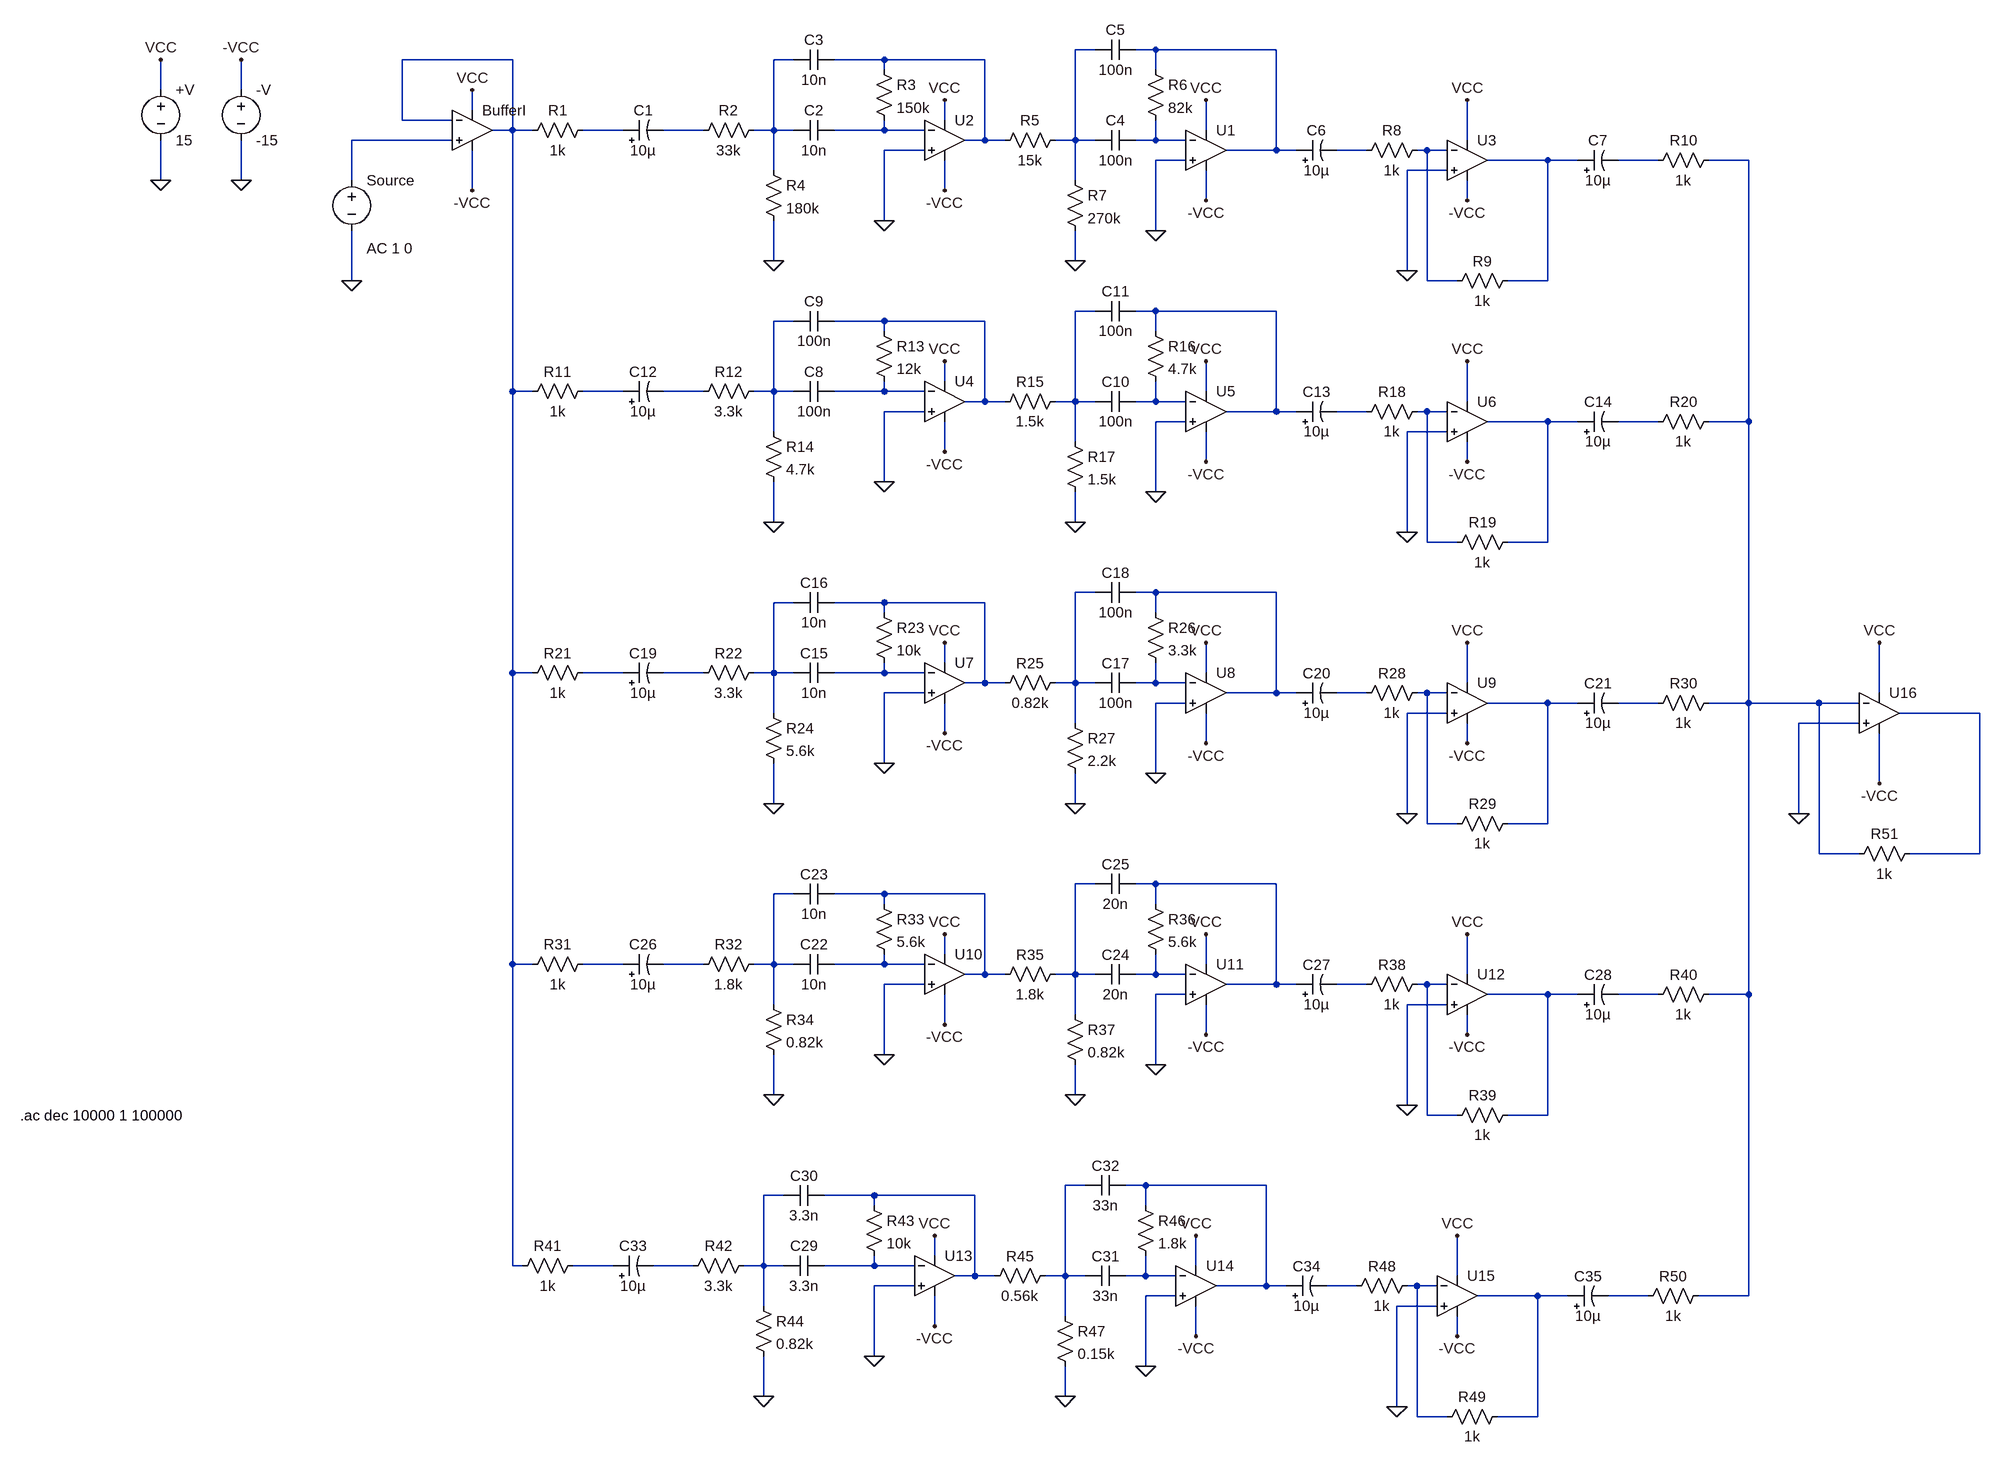
[diagram p0: schematic Five band equilizer final.asc]
Five band equilizer final.asc, the LTspice schematic file:
Version 4
SHEET 1 5876 2256
WIRE 976 32 944 32
WIRE 1072 32 1040 32
WIRE 1264 32 1072 32
WIRE 48 48 -128 48
WIRE 496 48 464 48
WIRE 640 48 560 48
WIRE 800 48 640 48
WIRE 640 64 640 48
WIRE 1072 64 1072 32
WIRE -512 96 -512 48
WIRE -384 96 -384 48
WIRE -16 128 -16 96
WIRE -128 144 -128 48
WIRE -48 144 -128 144
WIRE 736 144 736 112
WIRE 48 160 48 48
WIRE 48 160 16 160
WIRE 80 160 48 160
WIRE 224 160 160 160
WIRE 352 160 288 160
WIRE 464 160 464 48
WIRE 464 160 432 160
WIRE 496 160 464 160
WIRE 640 160 640 144
WIRE 640 160 560 160
WIRE 704 160 640 160
WIRE 1152 160 1152 112
WIRE -48 176 -208 176
WIRE 800 176 800 48
WIRE 800 176 768 176
WIRE 832 176 800 176
WIRE 944 176 944 32
WIRE 944 176 912 176
WIRE 976 176 944 176
WIRE 1072 176 1072 144
WIRE 1072 176 1040 176
WIRE 1120 176 1072 176
WIRE 1568 176 1568 112
WIRE 704 192 640 192
WIRE 1264 192 1264 32
WIRE 1264 192 1184 192
WIRE 1296 192 1264 192
WIRE 1408 192 1360 192
WIRE 1504 192 1488 192
WIRE 1536 192 1504 192
WIRE 1120 208 1072 208
WIRE 1696 208 1600 208
WIRE 1744 208 1696 208
WIRE 1872 208 1808 208
WIRE 2016 208 1952 208
WIRE 464 224 464 160
WIRE 1536 224 1472 224
WIRE -512 240 -512 176
WIRE -384 240 -384 176
WIRE -208 240 -208 176
WIRE 944 240 944 176
WIRE -16 256 -16 192
WIRE 736 256 736 208
WIRE 1152 272 1152 224
WIRE 1568 272 1568 240
WIRE 640 304 640 192
WIRE 1072 320 1072 208
WIRE 464 368 464 304
WIRE 944 368 944 320
WIRE 1472 384 1472 224
WIRE -208 400 -208 320
WIRE 1504 400 1504 192
WIRE 1552 400 1504 400
WIRE 1696 400 1696 208
WIRE 1696 400 1632 400
WIRE 976 448 944 448
WIRE 1072 448 1040 448
WIRE 1264 448 1072 448
WIRE 496 464 464 464
WIRE 640 464 560 464
WIRE 800 464 640 464
WIRE 640 480 640 464
WIRE 1072 480 1072 448
WIRE 736 560 736 528
WIRE 48 576 48 160
WIRE 80 576 48 576
WIRE 224 576 160 576
WIRE 352 576 288 576
WIRE 464 576 464 464
WIRE 464 576 432 576
WIRE 496 576 464 576
WIRE 640 576 640 560
WIRE 640 576 560 576
WIRE 704 576 640 576
WIRE 1152 576 1152 528
WIRE 800 592 800 464
WIRE 800 592 768 592
WIRE 832 592 800 592
WIRE 944 592 944 448
WIRE 944 592 912 592
WIRE 976 592 944 592
WIRE 1072 592 1072 560
WIRE 1072 592 1040 592
WIRE 1120 592 1072 592
WIRE 1568 592 1568 528
WIRE 704 608 640 608
WIRE 1264 608 1264 448
WIRE 1264 608 1184 608
WIRE 1296 608 1264 608
WIRE 1408 608 1360 608
WIRE 1504 608 1488 608
WIRE 1536 608 1504 608
WIRE 1120 624 1072 624
WIRE 1696 624 1600 624
WIRE 1744 624 1696 624
WIRE 1872 624 1808 624
WIRE 2016 624 2016 208
WIRE 2016 624 1952 624
WIRE 464 640 464 576
WIRE 1536 640 1472 640
WIRE 944 656 944 592
WIRE 736 672 736 624
WIRE 1152 688 1152 640
WIRE 1568 688 1568 656
WIRE 640 720 640 608
WIRE 1072 736 1072 624
WIRE 464 784 464 720
WIRE 944 784 944 736
WIRE 1472 800 1472 640
WIRE 1504 816 1504 608
WIRE 1552 816 1504 816
WIRE 1696 816 1696 624
WIRE 1696 816 1632 816
WIRE 976 896 944 896
WIRE 1072 896 1040 896
WIRE 1264 896 1072 896
WIRE 496 912 464 912
WIRE 640 912 560 912
WIRE 800 912 640 912
WIRE 640 928 640 912
WIRE 1072 928 1072 896
WIRE 736 1008 736 976
WIRE 48 1024 48 576
WIRE 80 1024 48 1024
WIRE 224 1024 160 1024
WIRE 352 1024 288 1024
WIRE 464 1024 464 912
WIRE 464 1024 432 1024
WIRE 496 1024 464 1024
WIRE 640 1024 640 1008
WIRE 640 1024 560 1024
WIRE 704 1024 640 1024
WIRE 1152 1024 1152 976
WIRE 800 1040 800 912
WIRE 800 1040 768 1040
WIRE 832 1040 800 1040
WIRE 944 1040 944 896
WIRE 944 1040 912 1040
WIRE 976 1040 944 1040
WIRE 1072 1040 1072 1008
WIRE 1072 1040 1040 1040
WIRE 1120 1040 1072 1040
WIRE 1568 1040 1568 976
WIRE 704 1056 640 1056
WIRE 1264 1056 1264 896
WIRE 1264 1056 1184 1056
WIRE 1296 1056 1264 1056
WIRE 1408 1056 1360 1056
WIRE 1504 1056 1488 1056
WIRE 1536 1056 1504 1056
WIRE 2224 1056 2224 976
WIRE 1120 1072 1072 1072
WIRE 1696 1072 1600 1072
WIRE 1744 1072 1696 1072
WIRE 1872 1072 1808 1072
WIRE 2016 1072 2016 624
WIRE 2016 1072 1952 1072
WIRE 2128 1072 2016 1072
WIRE 2192 1072 2128 1072
WIRE 464 1088 464 1024
WIRE 1536 1088 1472 1088
WIRE 2384 1088 2256 1088
WIRE 944 1104 944 1040
WIRE 2192 1104 2096 1104
WIRE 736 1120 736 1072
WIRE 1152 1136 1152 1088
WIRE 1568 1136 1568 1104
WIRE 640 1168 640 1056
WIRE 1072 1184 1072 1072
WIRE 2224 1200 2224 1120
WIRE 464 1232 464 1168
WIRE 944 1232 944 1184
WIRE 1472 1248 1472 1088
WIRE 2096 1248 2096 1104
WIRE 1504 1264 1504 1056
WIRE 1552 1264 1504 1264
WIRE 1696 1264 1696 1072
WIRE 1696 1264 1632 1264
WIRE 2128 1312 2128 1072
WIRE 2192 1312 2128 1312
WIRE 2384 1312 2384 1088
WIRE 2384 1312 2272 1312
WIRE 976 1360 944 1360
WIRE 1072 1360 1040 1360
WIRE 1264 1360 1072 1360
WIRE 496 1376 464 1376
WIRE 640 1376 560 1376
WIRE 800 1376 640 1376
WIRE 640 1392 640 1376
WIRE 1072 1392 1072 1360
WIRE 736 1472 736 1440
WIRE 48 1488 48 1024
WIRE 80 1488 48 1488
WIRE 224 1488 160 1488
WIRE 352 1488 288 1488
WIRE 464 1488 464 1376
WIRE 464 1488 432 1488
WIRE 496 1488 464 1488
WIRE 640 1488 640 1472
WIRE 640 1488 560 1488
WIRE 704 1488 640 1488
WIRE 1152 1488 1152 1440
WIRE 800 1504 800 1376
WIRE 800 1504 768 1504
WIRE 832 1504 800 1504
WIRE 944 1504 944 1360
WIRE 944 1504 912 1504
WIRE 976 1504 944 1504
WIRE 1072 1504 1072 1472
WIRE 1072 1504 1040 1504
WIRE 1120 1504 1072 1504
WIRE 1568 1504 1568 1440
WIRE 704 1520 640 1520
WIRE 1264 1520 1264 1360
WIRE 1264 1520 1184 1520
WIRE 1296 1520 1264 1520
WIRE 1408 1520 1360 1520
WIRE 1504 1520 1488 1520
WIRE 1536 1520 1504 1520
WIRE 1120 1536 1072 1536
WIRE 1696 1536 1600 1536
WIRE 1744 1536 1696 1536
WIRE 1872 1536 1808 1536
WIRE 2016 1536 2016 1072
WIRE 2016 1536 1952 1536
WIRE 464 1552 464 1488
WIRE 1536 1552 1472 1552
WIRE 944 1568 944 1504
WIRE 736 1584 736 1536
WIRE 1152 1600 1152 1552
WIRE 1568 1600 1568 1568
WIRE 640 1632 640 1520
WIRE 1072 1648 1072 1536
WIRE 464 1696 464 1632
WIRE 944 1696 944 1648
WIRE 1472 1712 1472 1552
WIRE 1504 1728 1504 1520
WIRE 1552 1728 1504 1728
WIRE 1696 1728 1696 1536
WIRE 1696 1728 1632 1728
WIRE 960 1840 928 1840
WIRE 1056 1840 1024 1840
WIRE 1248 1840 1056 1840
WIRE 480 1856 448 1856
WIRE 624 1856 544 1856
WIRE 784 1856 624 1856
WIRE 624 1872 624 1856
WIRE 1056 1872 1056 1840
WIRE 720 1952 720 1920
WIRE 48 1968 48 1488
WIRE 64 1968 48 1968
WIRE 208 1968 144 1968
WIRE 336 1968 272 1968
WIRE 448 1968 448 1856
WIRE 448 1968 416 1968
WIRE 480 1968 448 1968
WIRE 624 1968 624 1952
WIRE 624 1968 544 1968
WIRE 688 1968 624 1968
WIRE 1136 1968 1136 1920
WIRE 784 1984 784 1856
WIRE 784 1984 752 1984
WIRE 816 1984 784 1984
WIRE 928 1984 928 1840
WIRE 928 1984 896 1984
WIRE 960 1984 928 1984
WIRE 1056 1984 1056 1952
WIRE 1056 1984 1024 1984
WIRE 1104 1984 1056 1984
WIRE 1552 1984 1552 1920
WIRE 688 2000 624 2000
WIRE 1248 2000 1248 1840
WIRE 1248 2000 1168 2000
WIRE 1280 2000 1248 2000
WIRE 1392 2000 1344 2000
WIRE 1488 2000 1472 2000
WIRE 1520 2000 1488 2000
WIRE 1104 2016 1056 2016
WIRE 1680 2016 1584 2016
WIRE 1728 2016 1680 2016
WIRE 1856 2016 1792 2016
WIRE 2016 2016 2016 1536
WIRE 2016 2016 1936 2016
WIRE 448 2032 448 1968
WIRE 1520 2032 1456 2032
WIRE 928 2048 928 1984
WIRE 720 2064 720 2016
WIRE 1136 2080 1136 2032
WIRE 1552 2080 1552 2048
WIRE 624 2112 624 2000
WIRE 1056 2128 1056 2016
WIRE 448 2176 448 2112
WIRE 928 2176 928 2128
WIRE 1456 2192 1456 2032
WIRE 1488 2208 1488 2000
WIRE 1536 2208 1488 2208
WIRE 1680 2208 1680 2016
WIRE 1680 2208 1616 2208
FLAG 464 368 0
FLAG 640 304 0
FLAG -208 400 0
FLAG -512 240 0
FLAG -384 240 0
FLAG -512 48 VCC
FLAG -384 48 -VCC
FLAG -16 96 VCC
FLAG 736 112 VCC
FLAG -16 256 -VCC
FLAG 736 256 -VCC
FLAG 944 368 0
FLAG 1072 320 0
FLAG 1152 112 VCC
FLAG 1152 272 -VCC
FLAG 1472 384 0
FLAG 1568 112 VCC
FLAG 1568 272 -VCC
FLAG 464 784 0
FLAG 640 720 0
FLAG 736 528 VCC
FLAG 736 672 -VCC
FLAG 944 784 0
FLAG 1072 736 0
FLAG 1152 528 VCC
FLAG 1152 688 -VCC
FLAG 1472 800 0
FLAG 1568 528 VCC
FLAG 1568 688 -VCC
FLAG 464 1232 0
FLAG 640 1168 0
FLAG 736 976 VCC
FLAG 736 1120 -VCC
FLAG 944 1232 0
FLAG 1072 1184 0
FLAG 1152 976 VCC
FLAG 1152 1136 -VCC
FLAG 1472 1248 0
FLAG 1568 976 VCC
FLAG 1568 1136 -VCC
FLAG 464 1696 0
FLAG 640 1632 0
FLAG 736 1440 VCC
FLAG 736 1584 -VCC
FLAG 944 1696 0
FLAG 1072 1648 0
FLAG 1152 1440 VCC
FLAG 1152 1600 -VCC
FLAG 1472 1712 0
FLAG 1568 1440 VCC
FLAG 1568 1600 -VCC
FLAG 448 2176 0
FLAG 624 2112 0
FLAG 720 1920 VCC
FLAG 720 2064 -VCC
FLAG 928 2176 0
FLAG 1056 2128 0
FLAG 1136 1920 VCC
FLAG 1136 2080 -VCC
FLAG 1456 2192 0
FLAG 1552 1920 VCC
FLAG 1552 2080 -VCC
FLAG 2224 976 VCC
FLAG 2224 1200 -VCC
FLAG 2096 1248 0
SYMBOL OpAmps\\UniversalOpAmp2 -16 160 R0
SYMATTR InstName BufferI
SYMBOL res 176 144 R90
WINDOW 0 0 56 VBottom 2
WINDOW 3 32 56 VTop 2
SYMATTR InstName R1
SYMATTR Value 1k
SYMBOL res 448 144 R90
WINDOW 0 0 56 VBottom 2
WINDOW 3 32 56 VTop 2
SYMATTR InstName R2
SYMATTR Value 33k
SYMBOL cap 560 144 R90
WINDOW 0 0 32 VBottom 2
WINDOW 3 32 32 VTop 2
SYMATTR InstName C2
SYMATTR Value 10n
SYMBOL cap 560 32 R90
WINDOW 0 0 32 VBottom 2
WINDOW 3 32 32 VTop 2
SYMATTR InstName C3
SYMATTR Value 10n
SYMBOL res 624 48 R0
SYMATTR InstName R3
SYMATTR Value 150k
SYMBOL res 448 208 R0
SYMATTR InstName R4
SYMATTR Value 180k
SYMBOL OpAmps\\UniversalOpAmp2 736 176 R0
SYMATTR InstName U2
SYMBOL voltage -208 224 R0
WINDOW 123 24 124 Left 2
WINDOW 39 0 0 Left 0
SYMATTR Value2 AC 1 0
SYMATTR InstName Source
SYMATTR Value ""
SYMBOL voltage -512 80 R0
SYMATTR InstName +V
SYMATTR Value 15
SYMBOL voltage -384 80 R0
SYMATTR InstName -V
SYMATTR Value -15
SYMBOL res 928 160 R90
WINDOW 0 0 56 VBottom 2
WINDOW 3 32 56 VTop 2
SYMATTR InstName R5
SYMATTR Value 15k
SYMBOL cap 1040 160 R90
WINDOW 0 0 32 VBottom 2
WINDOW 3 32 32 VTop 2
SYMATTR InstName C4
SYMATTR Value 100n
SYMBOL cap 1040 16 R90
WINDOW 0 0 32 VBottom 2
WINDOW 3 32 32 VTop 2
SYMATTR InstName C5
SYMATTR Value 100n
SYMBOL OpAmps\\UniversalOpAmp2 1152 192 R0
SYMATTR InstName U1
SYMBOL res 1056 48 R0
SYMATTR InstName R6
SYMATTR Value 82k
SYMBOL res 928 224 R0
SYMATTR InstName R7
SYMATTR Value 270k
SYMBOL polcap 224 176 R270
WINDOW 0 32 32 VTop 2
WINDOW 3 0 32 VBottom 2
SYMATTR InstName C1
SYMATTR Value 10µ
SYMBOL polcap 1296 208 R270
WINDOW 0 32 32 VTop 2
WINDOW 3 0 32 VBottom 2
SYMATTR InstName C6
SYMATTR Value 10µ
SYMBOL OpAmps\\UniversalOpAmp2 1568 208 R0
SYMATTR InstName U3
SYMBOL res 1504 176 R90
WINDOW 0 0 56 VBottom 2
WINDOW 3 32 56 VTop 2
SYMATTR InstName R8
SYMATTR Value 1k
SYMBOL res 1648 384 R90
WINDOW 0 0 56 VBottom 2
WINDOW 3 32 56 VTop 2
SYMATTR InstName R9
SYMATTR Value 1k
SYMBOL polcap 1744 224 R270
WINDOW 0 32 32 VTop 2
WINDOW 3 0 32 VBottom 2
SYMATTR InstName C7
SYMATTR Value 10µ
SYMBOL res 1968 192 R90
WINDOW 0 0 56 VBottom 2
WINDOW 3 32 56 VTop 2
SYMATTR InstName R10
SYMATTR Value 1k
SYMBOL res 176 560 R90
WINDOW 0 0 56 VBottom 2
WINDOW 3 32 56 VTop 2
SYMATTR InstName R11
SYMATTR Value 1k
SYMBOL res 448 560 R90
WINDOW 0 0 56 VBottom 2
WINDOW 3 32 56 VTop 2
SYMATTR InstName R12
SYMATTR Value 3.3k
SYMBOL cap 560 560 R90
WINDOW 0 0 32 VBottom 2
WINDOW 3 32 32 VTop 2
SYMATTR InstName C8
SYMATTR Value 100n
SYMBOL cap 560 448 R90
WINDOW 0 0 32 VBottom 2
WINDOW 3 32 32 VTop 2
SYMATTR InstName C9
SYMATTR Value 100n
SYMBOL res 624 464 R0
SYMATTR InstName R13
SYMATTR Value 12k
SYMBOL res 448 624 R0
SYMATTR InstName R14
SYMATTR Value 4.7k
SYMBOL OpAmps\\UniversalOpAmp2 736 592 R0
SYMATTR InstName U4
SYMBOL res 928 576 R90
WINDOW 0 0 56 VBottom 2
WINDOW 3 32 56 VTop 2
SYMATTR InstName R15
SYMATTR Value 1.5k
SYMBOL cap 1040 576 R90
WINDOW 0 0 32 VBottom 2
WINDOW 3 32 32 VTop 2
SYMATTR InstName C10
SYMATTR Value 100n
SYMBOL cap 1040 432 R90
WINDOW 0 0 32 VBottom 2
WINDOW 3 32 32 VTop 2
SYMATTR InstName C11
SYMATTR Value 100n
SYMBOL OpAmps\\UniversalOpAmp2 1152 608 R0
SYMATTR InstName U5
SYMBOL res 1056 464 R0
SYMATTR InstName R16
SYMATTR Value 4.7k
SYMBOL res 928 640 R0
SYMATTR InstName R17
SYMATTR Value 1.5k
SYMBOL polcap 224 592 R270
WINDOW 0 32 32 VTop 2
WINDOW 3 0 32 VBottom 2
SYMATTR InstName C12
SYMATTR Value 10µ
SYMBOL polcap 1296 624 R270
WINDOW 0 32 32 VTop 2
WINDOW 3 0 32 VBottom 2
SYMATTR InstName C13
SYMATTR Value 10µ
SYMBOL OpAmps\\UniversalOpAmp2 1568 624 R0
SYMATTR InstName U6
SYMBOL res 1504 592 R90
WINDOW 0 0 56 VBottom 2
WINDOW 3 32 56 VTop 2
SYMATTR InstName R18
SYMATTR Value 1k
SYMBOL res 1648 800 R90
WINDOW 0 0 56 VBottom 2
WINDOW 3 32 56 VTop 2
SYMATTR InstName R19
SYMATTR Value 1k
SYMBOL polcap 1744 640 R270
WINDOW 0 32 32 VTop 2
WINDOW 3 0 32 VBottom 2
SYMATTR InstName C14
SYMATTR Value 10µ
SYMBOL res 1968 608 R90
WINDOW 0 0 56 VBottom 2
WINDOW 3 32 56 VTop 2
SYMATTR InstName R20
SYMATTR Value 1k
SYMBOL res 176 1008 R90
WINDOW 0 0 56 VBottom 2
WINDOW 3 32 56 VTop 2
SYMATTR InstName R21
SYMATTR Value 1k
SYMBOL res 448 1008 R90
WINDOW 0 0 56 VBottom 2
WINDOW 3 32 56 VTop 2
SYMATTR InstName R22
SYMATTR Value 3.3k
SYMBOL cap 560 1008 R90
WINDOW 0 0 32 VBottom 2
WINDOW 3 32 32 VTop 2
SYMATTR InstName C15
SYMATTR Value 10n
SYMBOL cap 560 896 R90
WINDOW 0 0 32 VBottom 2
WINDOW 3 32 32 VTop 2
SYMATTR InstName C16
SYMATTR Value 10n
SYMBOL res 624 912 R0
SYMATTR InstName R23
SYMATTR Value 10k
SYMBOL res 448 1072 R0
SYMATTR InstName R24
SYMATTR Value 5.6k
SYMBOL OpAmps\\UniversalOpAmp2 736 1040 R0
SYMATTR InstName U7
SYMBOL res 928 1024 R90
WINDOW 0 0 56 VBottom 2
WINDOW 3 32 56 VTop 2
SYMATTR InstName R25
SYMATTR Value 0.82k
SYMBOL cap 1040 1024 R90
WINDOW 0 0 32 VBottom 2
WINDOW 3 32 32 VTop 2
SYMATTR InstName C17
SYMATTR Value 100n
SYMBOL cap 1040 880 R90
WINDOW 0 0 32 VBottom 2
WINDOW 3 32 32 VTop 2
SYMATTR InstName C18
SYMATTR Value 100n
SYMBOL OpAmps\\UniversalOpAmp2 1152 1056 R0
SYMATTR InstName U8
SYMBOL res 1056 912 R0
SYMATTR InstName R26
SYMATTR Value 3.3k
SYMBOL res 928 1088 R0
SYMATTR InstName R27
SYMATTR Value 2.2k
SYMBOL polcap 224 1040 R270
WINDOW 0 32 32 VTop 2
WINDOW 3 0 32 VBottom 2
SYMATTR InstName C19
SYMATTR Value 10µ
SYMBOL polcap 1296 1072 R270
WINDOW 0 32 32 VTop 2
WINDOW 3 0 32 VBottom 2
SYMATTR InstName C20
SYMATTR Value 10µ
SYMBOL OpAmps\\UniversalOpAmp2 1568 1072 R0
SYMATTR InstName U9
SYMBOL res 1504 1040 R90
WINDOW 0 0 56 VBottom 2
WINDOW 3 32 56 VTop 2
SYMATTR InstName R28
SYMATTR Value 1k
SYMBOL res 1648 1248 R90
WINDOW 0 0 56 VBottom 2
WINDOW 3 32 56 VTop 2
SYMATTR InstName R29
SYMATTR Value 1k
SYMBOL polcap 1744 1088 R270
WINDOW 0 32 32 VTop 2
WINDOW 3 0 32 VBottom 2
SYMATTR InstName C21
SYMATTR Value 10µ
SYMBOL res 1968 1056 R90
WINDOW 0 0 56 VBottom 2
WINDOW 3 32 56 VTop 2
SYMATTR InstName R30
SYMATTR Value 1k
SYMBOL res 176 1472 R90
WINDOW 0 0 56 VBottom 2
WINDOW 3 32 56 VTop 2
SYMATTR InstName R31
SYMATTR Value 1k
SYMBOL res 448 1472 R90
WINDOW 0 0 56 VBottom 2
WINDOW 3 32 56 VTop 2
SYMATTR InstName R32
SYMATTR Value 1.8k
SYMBOL cap 560 1472 R90
WINDOW 0 0 32 VBottom 2
WINDOW 3 32 32 VTop 2
SYMATTR InstName C22
SYMATTR Value 10n
SYMBOL cap 560 1360 R90
WINDOW 0 0 32 VBottom 2
WINDOW 3 32 32 VTop 2
SYMATTR InstName C23
SYMATTR Value 10n
SYMBOL res 624 1376 R0
SYMATTR InstName R33
SYMATTR Value 5.6k
SYMBOL res 448 1536 R0
SYMATTR InstName R34
SYMATTR Value 0.82k
SYMBOL OpAmps\\UniversalOpAmp2 736 1504 R0
SYMATTR InstName U10
SYMBOL res 928 1488 R90
WINDOW 0 0 56 VBottom 2
WINDOW 3 32 56 VTop 2
SYMATTR InstName R35
SYMATTR Value 1.8k
SYMBOL cap 1040 1488 R90
WINDOW 0 0 32 VBottom 2
WINDOW 3 32 32 VTop 2
SYMATTR InstName C24
SYMATTR Value 20n
SYMBOL cap 1040 1344 R90
WINDOW 0 0 32 VBottom 2
WINDOW 3 32 32 VTop 2
SYMATTR InstName C25
SYMATTR Value 20n
SYMBOL OpAmps\\UniversalOpAmp2 1152 1520 R0
SYMATTR InstName U11
SYMBOL res 1056 1376 R0
SYMATTR InstName R36
SYMATTR Value 5.6k
SYMBOL res 928 1552 R0
SYMATTR InstName R37
SYMATTR Value 0.82k
SYMBOL polcap 224 1504 R270
WINDOW 0 32 32 VTop 2
WINDOW 3 0 32 VBottom 2
SYMATTR InstName C26
SYMATTR Value 10µ
SYMBOL polcap 1296 1536 R270
WINDOW 0 32 32 VTop 2
WINDOW 3 0 32 VBottom 2
SYMATTR InstName C27
SYMATTR Value 10µ
SYMBOL OpAmps\\UniversalOpAmp2 1568 1536 R0
SYMATTR InstName U12
SYMBOL res 1504 1504 R90
WINDOW 0 0 56 VBottom 2
WINDOW 3 32 56 VTop 2
SYMATTR InstName R38
SYMATTR Value 1k
SYMBOL res 1648 1712 R90
WINDOW 0 0 56 VBottom 2
WINDOW 3 32 56 VTop 2
SYMATTR InstName R39
SYMATTR Value 1k
SYMBOL polcap 1744 1552 R270
WINDOW 0 32 32 VTop 2
WINDOW 3 0 32 VBottom 2
SYMATTR InstName C28
SYMATTR Value 10µ
SYMBOL res 1968 1520 R90
WINDOW 0 0 56 VBottom 2
WINDOW 3 32 56 VTop 2
SYMATTR InstName R40
SYMATTR Value 1k
SYMBOL res 160 1952 R90
WINDOW 0 0 56 VBottom 2
WINDOW 3 32 56 VTop 2
SYMATTR InstName R41
SYMATTR Value 1k
SYMBOL res 432 1952 R90
WINDOW 0 0 56 VBottom 2
WINDOW 3 32 56 VTop 2
SYMATTR InstName R42
SYMATTR Value 3.3k
SYMBOL cap 544 1952 R90
WINDOW 0 0 32 VBottom 2
WINDOW 3 32 32 VTop 2
SYMATTR InstName C29
SYMATTR Value 3.3n
SYMBOL cap 544 1840 R90
WINDOW 0 0 32 VBottom 2
WINDOW 3 32 32 VTop 2
SYMATTR InstName C30
SYMATTR Value 3.3n
SYMBOL res 608 1856 R0
SYMATTR InstName R43
SYMATTR Value 10k
SYMBOL res 432 2016 R0
SYMATTR InstName R44
SYMATTR Value 0.82k
SYMBOL OpAmps\\UniversalOpAmp2 720 1984 R0
SYMATTR InstName U13
SYMBOL res 912 1968 R90
WINDOW 0 0 56 VBottom 2
WINDOW 3 32 56 VTop 2
SYMATTR InstName R45
SYMATTR Value 0.56k
SYMBOL cap 1024 1968 R90
WINDOW 0 0 32 VBottom 2
WINDOW 3 32 32 VTop 2
SYMATTR InstName C31
SYMATTR Value 33n
SYMBOL cap 1024 1824 R90
WINDOW 0 0 32 VBottom 2
WINDOW 3 32 32 VTop 2
SYMATTR InstName C32
SYMATTR Value 33n
SYMBOL OpAmps\\UniversalOpAmp2 1136 2000 R0
SYMATTR InstName U14
SYMBOL res 1040 1856 R0
SYMATTR InstName R46
SYMATTR Value 1.8k
SYMBOL res 912 2032 R0
SYMATTR InstName R47
SYMATTR Value 0.15k
SYMBOL polcap 208 1984 R270
WINDOW 0 32 32 VTop 2
WINDOW 3 0 32 VBottom 2
SYMATTR InstName C33
SYMATTR Value 10µ
SYMBOL polcap 1280 2016 R270
WINDOW 0 32 32 VTop 2
WINDOW 3 0 32 VBottom 2
SYMATTR InstName C34
SYMATTR Value 10µ
SYMBOL OpAmps\\UniversalOpAmp2 1552 2016 R0
SYMATTR InstName U15
SYMBOL res 1488 1984 R90
WINDOW 0 0 56 VBottom 2
WINDOW 3 32 56 VTop 2
SYMATTR InstName R48
SYMATTR Value 1k
SYMBOL res 1632 2192 R90
WINDOW 0 0 56 VBottom 2
WINDOW 3 32 56 VTop 2
SYMATTR InstName R49
SYMATTR Value 1k
SYMBOL polcap 1728 2032 R270
WINDOW 0 32 32 VTop 2
WINDOW 3 0 32 VBottom 2
SYMATTR InstName C35
SYMATTR Value 10µ
SYMBOL res 1952 2000 R90
WINDOW 0 0 56 VBottom 2
WINDOW 3 32 56 VTop 2
SYMATTR InstName R50
SYMATTR Value 1k
SYMBOL OpAmps\\UniversalOpAmp2 2224 1088 R0
SYMATTR InstName U16
SYMBOL res 2288 1296 R90
WINDOW 0 0 56 VBottom 2
WINDOW 3 32 56 VTop 2
SYMATTR InstName R51
SYMATTR Value 1k
TEXT -736 1728 Left 2 !.ac dec 10000 1 100000

The netlist it stands for:
* Five band equilizer final.asc
XBufferI N009 N003 VCC -VCC N003 level2 Avol=1Meg GBW=10Meg Slew=10Meg Ilimit=25m Rail=0 Vos=0 En=0 Enk=0 In=0 Ink=0 Rin=500Meg  ; pins In+ In- V+ V- OUT
R1 N006 N003 1k
R2 N004 N007 33k
C2 N008 N004 10n
C3 N005 N004 10n
R3 N005 N008 150k
R4 N004 0 180k
XU2 0 N008 VCC -VCC N005 level2 Avol=1Meg GBW=10Meg Slew=10Meg Ilimit=25m Rail=0 Vos=0 En=0 Enk=0 In=0 Ink=0 Rin=500Meg  ; pins In+ In- V+ V- OUT
V§Source N009 0 AC 1 0
V§+V VCC 0 15
V§-V -VCC 0 -15
R5 N001 N005 15k
C4 N010 N001 100n
C5 N002 N001 100n
XU1 0 N010 VCC -VCC N002 level2 Avol=1Meg GBW=10Meg Slew=10Meg Ilimit=25m Rail=0 Vos=0 En=0 Enk=0 In=0 Ink=0 Rin=500Meg  ; pins In+ In- V+ V- OUT
R6 N002 N010 82k
R7 N001 0 270k
C1 N006 N007 10µ
C6 N002 N011 10µ
XU3 0 N012 VCC -VCC N013 level2 Avol=1Meg GBW=10Meg Slew=10Meg Ilimit=25m Rail=0 Vos=0 En=0 Enk=0 In=0 Ink=0 Rin=500Meg  ; pins In+ In- V+ V- OUT
R8 N012 N011 1k
R9 N013 N012 1k
C7 N013 N014 10µ
R10 N015 N014 1k
R11 N020 N003 1k
R12 N018 N021 3.3k
C8 N022 N018 100n
C9 N019 N018 100n
R13 N019 N022 12k
R14 N018 0 4.7k
XU4 0 N022 VCC -VCC N019 level2 Avol=1Meg GBW=10Meg Slew=10Meg Ilimit=25m Rail=0 Vos=0 En=0 Enk=0 In=0 Ink=0 Rin=500Meg  ; pins In+ In- V+ V- OUT
R15 N016 N019 1.5k
C10 N023 N016 100n
C11 N017 N016 100n
XU5 0 N023 VCC -VCC N017 level2 Avol=1Meg GBW=10Meg Slew=10Meg Ilimit=25m Rail=0 Vos=0 En=0 Enk=0 In=0 Ink=0 Rin=500Meg  ; pins In+ In- V+ V- OUT
R16 N017 N023 4.7k
R17 N016 0 1.5k
C12 N020 N021 10µ
C13 N017 N024 10µ
XU6 0 N025 VCC -VCC N026 level2 Avol=1Meg GBW=10Meg Slew=10Meg Ilimit=25m Rail=0 Vos=0 En=0 Enk=0 In=0 Ink=0 Rin=500Meg  ; pins In+ In- V+ V- OUT
R18 N025 N024 1k
R19 N026 N025 1k
C14 N026 N027 10µ
R20 N015 N027 1k
R21 N032 N003 1k
R22 N030 N033 3.3k
C15 N034 N030 10n
C16 N031 N030 10n
R23 N031 N034 10k
R24 N030 0 5.6k
XU7 0 N034 VCC -VCC N031 level2 Avol=1Meg GBW=10Meg Slew=10Meg Ilimit=25m Rail=0 Vos=0 En=0 Enk=0 In=0 Ink=0 Rin=500Meg  ; pins In+ In- V+ V- OUT
R25 N028 N031 0.82k
C17 N035 N028 100n
C18 N029 N028 100n
XU8 0 N035 VCC -VCC N029 level2 Avol=1Meg GBW=10Meg Slew=10Meg Ilimit=25m Rail=0 Vos=0 En=0 Enk=0 In=0 Ink=0 Rin=500Meg  ; pins In+ In- V+ V- OUT
R26 N029 N035 3.3k
R27 N028 0 2.2k
C19 N032 N033 10µ
C20 N029 N036 10µ
XU9 0 N037 VCC -VCC N038 level2 Avol=1Meg GBW=10Meg Slew=10Meg Ilimit=25m Rail=0 Vos=0 En=0 Enk=0 In=0 Ink=0 Rin=500Meg  ; pins In+ In- V+ V- OUT
R28 N037 N036 1k
R29 N038 N037 1k
C21 N038 N039 10µ
R30 N015 N039 1k
R31 N045 N003 1k
R32 N043 N046 1.8k
C22 N047 N043 10n
C23 N044 N043 10n
R33 N044 N047 5.6k
R34 N043 0 0.82k
XU10 0 N047 VCC -VCC N044 level2 Avol=1Meg GBW=10Meg Slew=10Meg Ilimit=25m Rail=0 Vos=0 En=0 Enk=0 In=0 Ink=0 Rin=500Meg  ; pins In+ In- V+ V- OUT
R35 N041 N044 1.8k
C24 N048 N041 20n
C25 N042 N041 20n
XU11 0 N048 VCC -VCC N042 level2 Avol=1Meg GBW=10Meg Slew=10Meg Ilimit=25m Rail=0 Vos=0 En=0 Enk=0 In=0 Ink=0 Rin=500Meg  ; pins In+ In- V+ V- OUT
R36 N042 N048 5.6k
R37 N041 0 0.82k
C26 N045 N046 10µ
C27 N042 N049 10µ
XU12 0 N050 VCC -VCC N051 level2 Avol=1Meg GBW=10Meg Slew=10Meg Ilimit=25m Rail=0 Vos=0 En=0 Enk=0 In=0 Ink=0 Rin=500Meg  ; pins In+ In- V+ V- OUT
R38 N050 N049 1k
R39 N051 N050 1k
C28 N051 N052 10µ
R40 N015 N052 1k
R41 N057 N003 1k
R42 N055 N058 3.3k
C29 N059 N055 3.3n
C30 N056 N055 3.3n
R43 N056 N059 10k
R44 N055 0 0.82k
XU13 0 N059 VCC -VCC N056 level2 Avol=1Meg GBW=10Meg Slew=10Meg Ilimit=25m Rail=0 Vos=0 En=0 Enk=0 In=0 Ink=0 Rin=500Meg  ; pins In+ In- V+ V- OUT
R45 N053 N056 0.56k
C31 N060 N053 33n
C32 N054 N053 33n
XU14 0 N060 VCC -VCC N054 level2 Avol=1Meg GBW=10Meg Slew=10Meg Ilimit=25m Rail=0 Vos=0 En=0 Enk=0 In=0 Ink=0 Rin=500Meg  ; pins In+ In- V+ V- OUT
R46 N054 N060 1.8k
R47 N053 0 0.15k
C33 N057 N058 10µ
C34 N054 N061 10µ
XU15 0 N062 VCC -VCC N063 level2 Avol=1Meg GBW=10Meg Slew=10Meg Ilimit=25m Rail=0 Vos=0 En=0 Enk=0 In=0 Ink=0 Rin=500Meg  ; pins In+ In- V+ V- OUT
R48 N062 N061 1k
R49 N063 N062 1k
C35 N063 N064 10µ
R50 N015 N064 1k
XU16 0 N015 VCC -VCC N040 level2 Avol=1Meg GBW=10Meg Slew=10Meg Ilimit=25m Rail=0 Vos=0 En=0 Enk=0 In=0 Ink=0 Rin=500Meg  ; pins In+ In- V+ V- OUT
R51 N040 N015 1k
.ac dec 10000 1 100000
.lib UniversalOpAmp2.lib
.backanno
.end